# Altium schematic sheet 颜色传感器.SchDoc
size A3
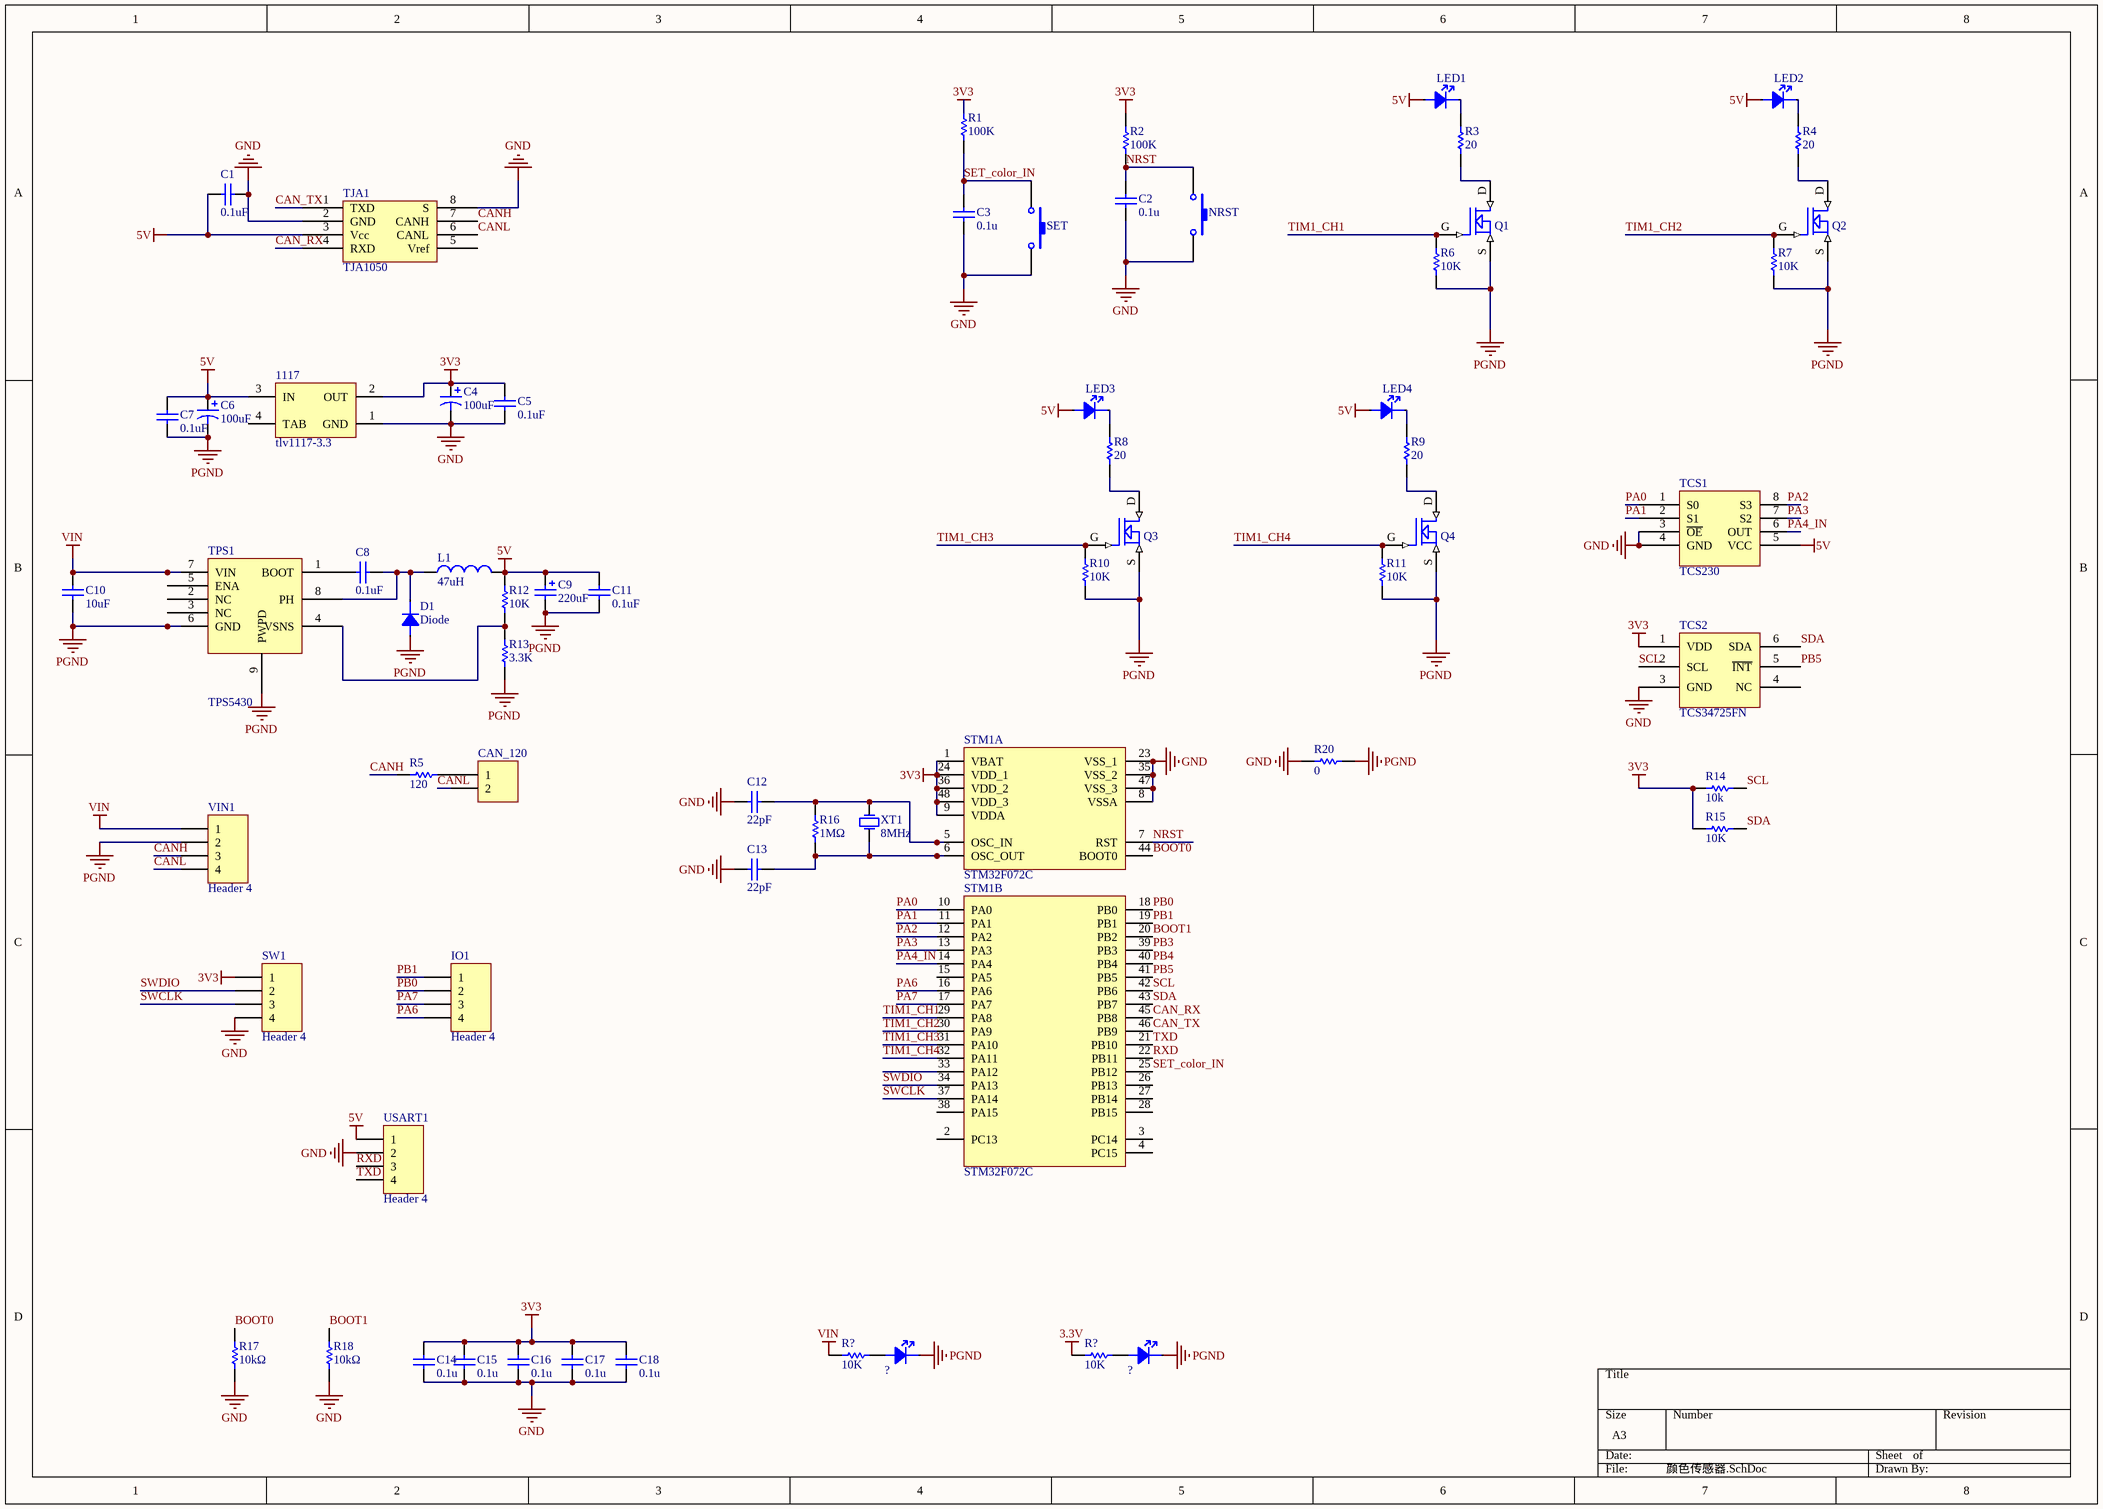
[diagram p0: 颜色传感器.SchDoc]

## Parts
(Parts that share a designator on the sheet are numbered #1, #2 ... from top to bottom, then left to right.)
1117  tlv1117-3.3  [LM1117]
?#1  lED  [0805D]  (value not drawn)
?#2  lED  [0805D]  (value not drawn)
C1  value 0.1uF  [CAP-MLCC-0603]  (hidden comment: Cap)
C2  0.1u  [CAP-MLCC-0603]
C3  0.1u  [CAP-MLCC-0603]
C4  value 100uF  [6032C]  (hidden comment: Cap Pol3)
C5  value 0.1uF  [CAP-MLCC-0603]  (hidden comment: Cap)
C6  value 100uF  [6032C]  (hidden comment: Cap Pol3)
C7  value 0.1uF  [CAP-MLCC-0603]  (hidden comment: Cap)
C8  value 0.1uF  [CAP-MLCC-0603]  (hidden comment: Cap)
C9  value 220uF  [6032C]  (hidden comment: Cap Pol1)
C10  value 10uF  [0805C]  (hidden comment: Cap)
C11  value 0.1uF  [CAP-MLCC-0603]  (hidden comment: Cap)
C12  22pF  [CAP-MLCC-0603]
C13  22pF  [CAP-MLCC-0603]
C14  0.1u  [CAP-MLCC-0603]
C15  0.1u  [CAP-MLCC-0603]
C16  0.1u  [CAP-MLCC-0603]
C17  0.1u  [CAP-MLCC-0603]
C18  0.1u  [CAP-MLCC-0603]
CAN_120  Header 2  [SIP2]  (value not drawn)
D1  Diode  [SS34]
IO1  Header 4  [HDR1X4]
L1  value 47uH  [IND_CD52]  (hidden comment: Inductor)
LED1  lED  [LED直插8MM]  (value not drawn)
LED2  lED  [LED直插8MM]  (value not drawn)
LED3  lED  [LED直插8MM]  (value not drawn)
LED4  lED  [LED直插8MM]  (value not drawn)
NRST  SW-PB  [KEY]  (value not drawn)
Q1  MOSFET N  [NMOS_SOT23]  (value not drawn)
Q2  MOSFET N  [NMOS_SOT23]  (value not drawn)
Q3  MOSFET N  [NMOS_SOT23]  (value not drawn)
Q4  MOSFET N  [NMOS_SOT23]  (value not drawn)
R1  value 100K  [RES-0603]  (hidden comment: RES)
R2  value 100K  [RES-0603]  (hidden comment: RES)
R3  20  [RES-0805]
R4  20  [RES-0805]
R5  value 120  [RES-0603]  (hidden comment: Res1)
R6  10K  [RES-0603]
R7  10K  [RES-0603]
R8  20  [RES-0805]
R9  20  [RES-0805]
R10  10K  [RES-0603]
R11  10K  [RES-0603]
R12  value 10K  [RES-0603]  (hidden comment: Res1)
R13  value 3.3K  [RES-0603]  (hidden comment: Res1)
R14  10k  [RES-0603]
R15  10K  [RES-0603]
R16  1MΩ  [RES-0603]
R17  value 10kΩ  [RES-0603]  (hidden comment: RES)
R18  value 10kΩ  [RES-0603]  (hidden comment: RES)
R20  0  [RES-0805]
R?#1  value 10K  [RES-0603]  (hidden comment: Res1)
R?#2  value 10K  [RES-0603]  (hidden comment: Res1)
SET  SW-PB  [KEY]  (value not drawn)
STM1  STM32F072C  [LQFP_P0.5_48]  (parts A,B of 2)
SW1  Header 4  [HDR1X4]
TCS1  TCS230  [SOP_E150_8]
TCS2  TCS34725FN  [DFN-6]
TJA1  TJA1050  [TJA1050]
TPS1  TPS5430  [TPS5430]
USART1  Header 4  [HDR1X4]
VIN1  Header 4  [XH-2.54pin4]
XT1  value 8MHz  [XT_5032_2]  (hidden comment: XTAL_5032_2P)

## Nets
3.3V: R?#2.2
3V3: 1117.2(OUT) C4.1 C5.1 C14.2 C15.2 C16.2 C17.2 C18.2 R1.2 R2.2 R14.1 R15.1 STM1.1(VBAT) STM1.9(VDDA) STM1.24(VDD_1) STM1.36(VDD_2) STM1.48(VDD_3) SW1.1 TCS2.1(VDD)
5V: 1117.3(IN) C1.1 C6.1 C7.1 C9.1 C11.2 L1.2 LED1.A LED2.A LED3.A LED4.A R12.2 TCS1.5(VCC) TJA1.3(Vcc) USART1.1
GND: 1117.1(GND) C1.2 C2.1 C3.1 C4.2 C5.2 C12.1 C13.1 C14.1 C15.1 C16.1 C17.1 C18.1 NRST.2 R17.1 R18.1 R20.1 SET.2 STM1.8(VSSA) STM1.23(VSS_1) STM1.35(VSS_2) STM1.47(VSS_3) SW1.4 TCS1.3(~{OE}) TCS1.4(GND) TCS2.3(GND) TJA1.2(GND) TJA1.8(S) USART1.2
PGND: ?#1.K ?#2.K C6.2 C7.2 C9.2 C10.1 C11.1 D1.A Q1.S Q2.S Q3.S Q4.S R6.2 R7.2 R10.2 R11.2 R13.1 R20.2 TPS1.6(GND) TPS1.9(PWPD) VIN1.2
VIN: C10.2 R?#1.2 TPS1.7(VIN) VIN1.1
BOOT0: R17.2 STM1.44(BOOT0)
BOOT1: R18.2 STM1.20(PB2)
CAN_RX: STM1.45(PB8) TJA1.4(RXD)
CAN_TX: STM1.46(PB9) TJA1.1(TXD)
CANH: R5.2 TJA1.7(CANH) VIN1.3
CANL: CAN_120.2 TJA1.6(CANL) VIN1.4
NRST: C2.2 NRST.1 R2.1 STM1.7(RST)
PA0: STM1.10(PA0) TCS1.1(S0)
PA1: STM1.11(PA1) TCS1.2(S1)
PA2: STM1.12(PA2) TCS1.8(S3)
PA3: STM1.13(PA3) TCS1.7(S2)
PA4_IN: STM1.14(PA4) TCS1.6(OUT)
PA6: IO1.4 STM1.16(PA6)
PA7: IO1.3 STM1.17(PA7)
PB0: IO1.2 STM1.18(PB0)
PB1: IO1.1 STM1.19(PB1)
PB3: STM1.39(PB3)
PB4: STM1.40(PB4)
PB5: STM1.41(PB5) TCS2.5(~{INT})
RXD: STM1.22(PB11) USART1.3
SCL: R14.2 STM1.42(PB6) TCS2.2(SCL)
SDA: R15.2 STM1.43(PB7) TCS2.6(SDA)
SET_color_IN: C3.2 R1.1 SET.1 STM1.25(PB12)
SWCLK: STM1.37(PA14) SW1.3
SWDIO: STM1.34(PA13) SW1.2
TIM1_CH1: Q1.G R6.1 STM1.29(PA8)
TIM1_CH2: Q2.G R7.1 STM1.30(PA9)
TIM1_CH3: Q3.G R10.1 STM1.31(PA10)
TIM1_CH4: Q4.G R11.1 STM1.32(PA11)
TXD: STM1.21(PB10) USART1.4
Net?#1_A: ?#1.A R?#1.1
Net?#2_A: ?#2.A R?#2.1
NetC8_1: C8.1 TPS1.1(BOOT)
NetC8_2: C8.2 D1.K L1.1 TPS1.8(PH)
NetC12_2: C12.2 R16.2 STM1.5(OSC_IN) XT1.2(OSC2)
NetC13_2: C13.2 R16.1 STM1.6(OSC_OUT) XT1.1(OSC1)
NetCAN_120_1: CAN_120.1 R5.1
NetLED1_K: LED1.K R3.1
NetLED2_K: LED2.K R4.1
NetLED3_K: LED3.K R8.1
NetLED4_K: LED4.K R9.1
NetQ1_D: Q1.D R3.2
NetQ2_D: Q2.D R4.2
NetQ3_D: Q3.D R8.2
NetQ4_D: Q4.D R9.2
NetR12_1: R12.1 R13.2 TPS1.4(VSNS)

Not connected (* = marked no-connect by the designer): 1117 4(TAB); STM1 2(PC13) 3(PC14) 4(PC15) 15(PA5) 26(PB13) 27(PB14) 28(PB15) 33(PA12) 38(PA15); TCS2 4(NC); TJA1 5(Vref); TPS1 2(NC) 3(NC) 5(ENA)

## Library data of the parts
1117 = LM1117IMP-5.0: 800mA Low-Dropout Linear Regulator; Manufacturer: National Semiconductor; CompType: LDO IC; PackageTopMarking: XYTT*N06B; PowerWise: N; Published: 4-Dec-2008; DatasheetVersion: Apr-2006; PackageVersion: revB, Apr-2003; PackageReference: MP04A; Publisher: Altium Limited; PackageDescription: Molded SOT-223, 6.50 x 3.56 x 1.6mm Body, 4 Lead, 2.3mm Pitch; PartNumber: LM1117IMP-5.0; RoHS: O; PinCount: 4; DigiKeyPartNumber: LM1117IMP-5.0CT-ND; Code_JEDEC: TO-261-AA; Code_IPC: SOT223-4; ComponentLink1Description: LM1117 Datasheet; ComponentLink1URL: http://www.national.com/ds/LM/LM1117.pdf; ComponentLink2Description: LM1117 Web Page; ComponentLink2URL: http://www.national.com/pf/LM/LM1117.html; ComponentLink3Description: MP04A Package Page; ComponentLink3URL: http://www.national.com/packaging/folders/mp04a.html
?#1 ?#2 LED1-LED4 = 00-D-LED
C1 C5 C7 C8 C10 C11 = Cap: Capacitor; Published: 8-Jun-2000; LatestRevisionDate: 17-Jul-2002; LatestRevisionNote: Re-released for DXP Platform.; PackageReference: RAD-0.3; Publisher: Altium Limited
C2 C3 C12-C18 = CAP: 无极性电容; Value: *μF; Published: 8-Jun-2000; LatestRevisionDate: 17-Jul-2002; LatestRevisionNote: Re-released for DXP Platform.; PackageReference: RAD-0.3; Publisher: Altium Limited; PackageDescription: Radial Cap, Thru-Hole; 2 Leads; 0.3 in Pin Spacing
C4 C6 = Cap Pol3: Polarized Capacitor (Surface Mount); Published: 8-Jun-2000; LatestRevisionDate: 17-Jul-2002; LatestRevisionNote: Re-released for DXP Platform.; PackageReference: C0805; Publisher: Altium Limited
C9 = Cap Pol1: Polarized Capacitor (Radial); Published: 8-Jun-2000; LatestRevisionDate: 17-Jul-2002; LatestRevisionNote: Re-released for DXP Platform.; PackageReference: RB7.6-15; Publisher: Altium Limited
CAN_120 = Header 2: Header, 2-Pin; LatestRevisionDate: 17-Jul-2002; LatestRevisionNote: Re-released for DXP Platform.; Publisher: Altium Limited
IO1 SW1 USART1 VIN1 = Header 4: Header, 4-Pin; LatestRevisionDate: 17-Jul-2002; LatestRevisionNote: Re-released for DXP Platform.; Publisher: Altium Limited
L1 = Inductor: Code_IEC: 1005; Published: 8-Jun-2000; LatestRevisionDate: 17-Jul-2002; LatestRevisionNote: Re-released for DXP Platform.; PackageReference: 0402-A; Publisher: Altium Limited; Code_JEITA: 0402
NRST SET = SW-PB: Switch; Published: 24-Mar-1999; LatestRevisionDate: 17-Jul-2002; LatestRevisionNote: Re-released for DXP Platform.; PackageReference: SPST-2; Publisher: Altium Limited; PackageDescription: Switch; 2 Leads
R1 R2 R17 R18 = RES: 电阻; Published: 8-Jun-2000; LatestRevisionDate: 17-Jul-2002; LatestRevisionNote: Re-released for DXP Platform.; PackageReference: AXIAL-0.3; Publisher: Altium Limited; PackageDescription: Axial Device, Thru-Hole; 2 Leads; 0.3 in Pin Spacing
R3 R4 R6-R11 R14-R16 R20 = RES: 电阻; Value: *kΩ; Published: 8-Jun-2000; LatestRevisionDate: 17-Jul-2002; LatestRevisionNote: Re-released for DXP Platform.; PackageReference: AXIAL-0.3; Publisher: Altium Limited; PackageDescription: Axial Device, Thru-Hole; 2 Leads; 0.3 in Pin Spacing
R5 R12 R13 R?#1 R?#2 = Res1: Resistor; Published: 8-Jun-2000; LatestRevisionDate: 17-Jul-2002; LatestRevisionNote: Re-released for DXP Platform.; PackageReference: AXIAL-0.3; Publisher: Altium Limited
STM1 = STM32F103C: MCU
TCS2 = TCS34725FN: 颜色传感器
TJA1 = TJA1050: CAN总线收发器
XT1 = XTAL_5032_2P: Crystal Oscillator